# EAGLE design PIB Quadcopter PCB (EAGLE 9.6.2)
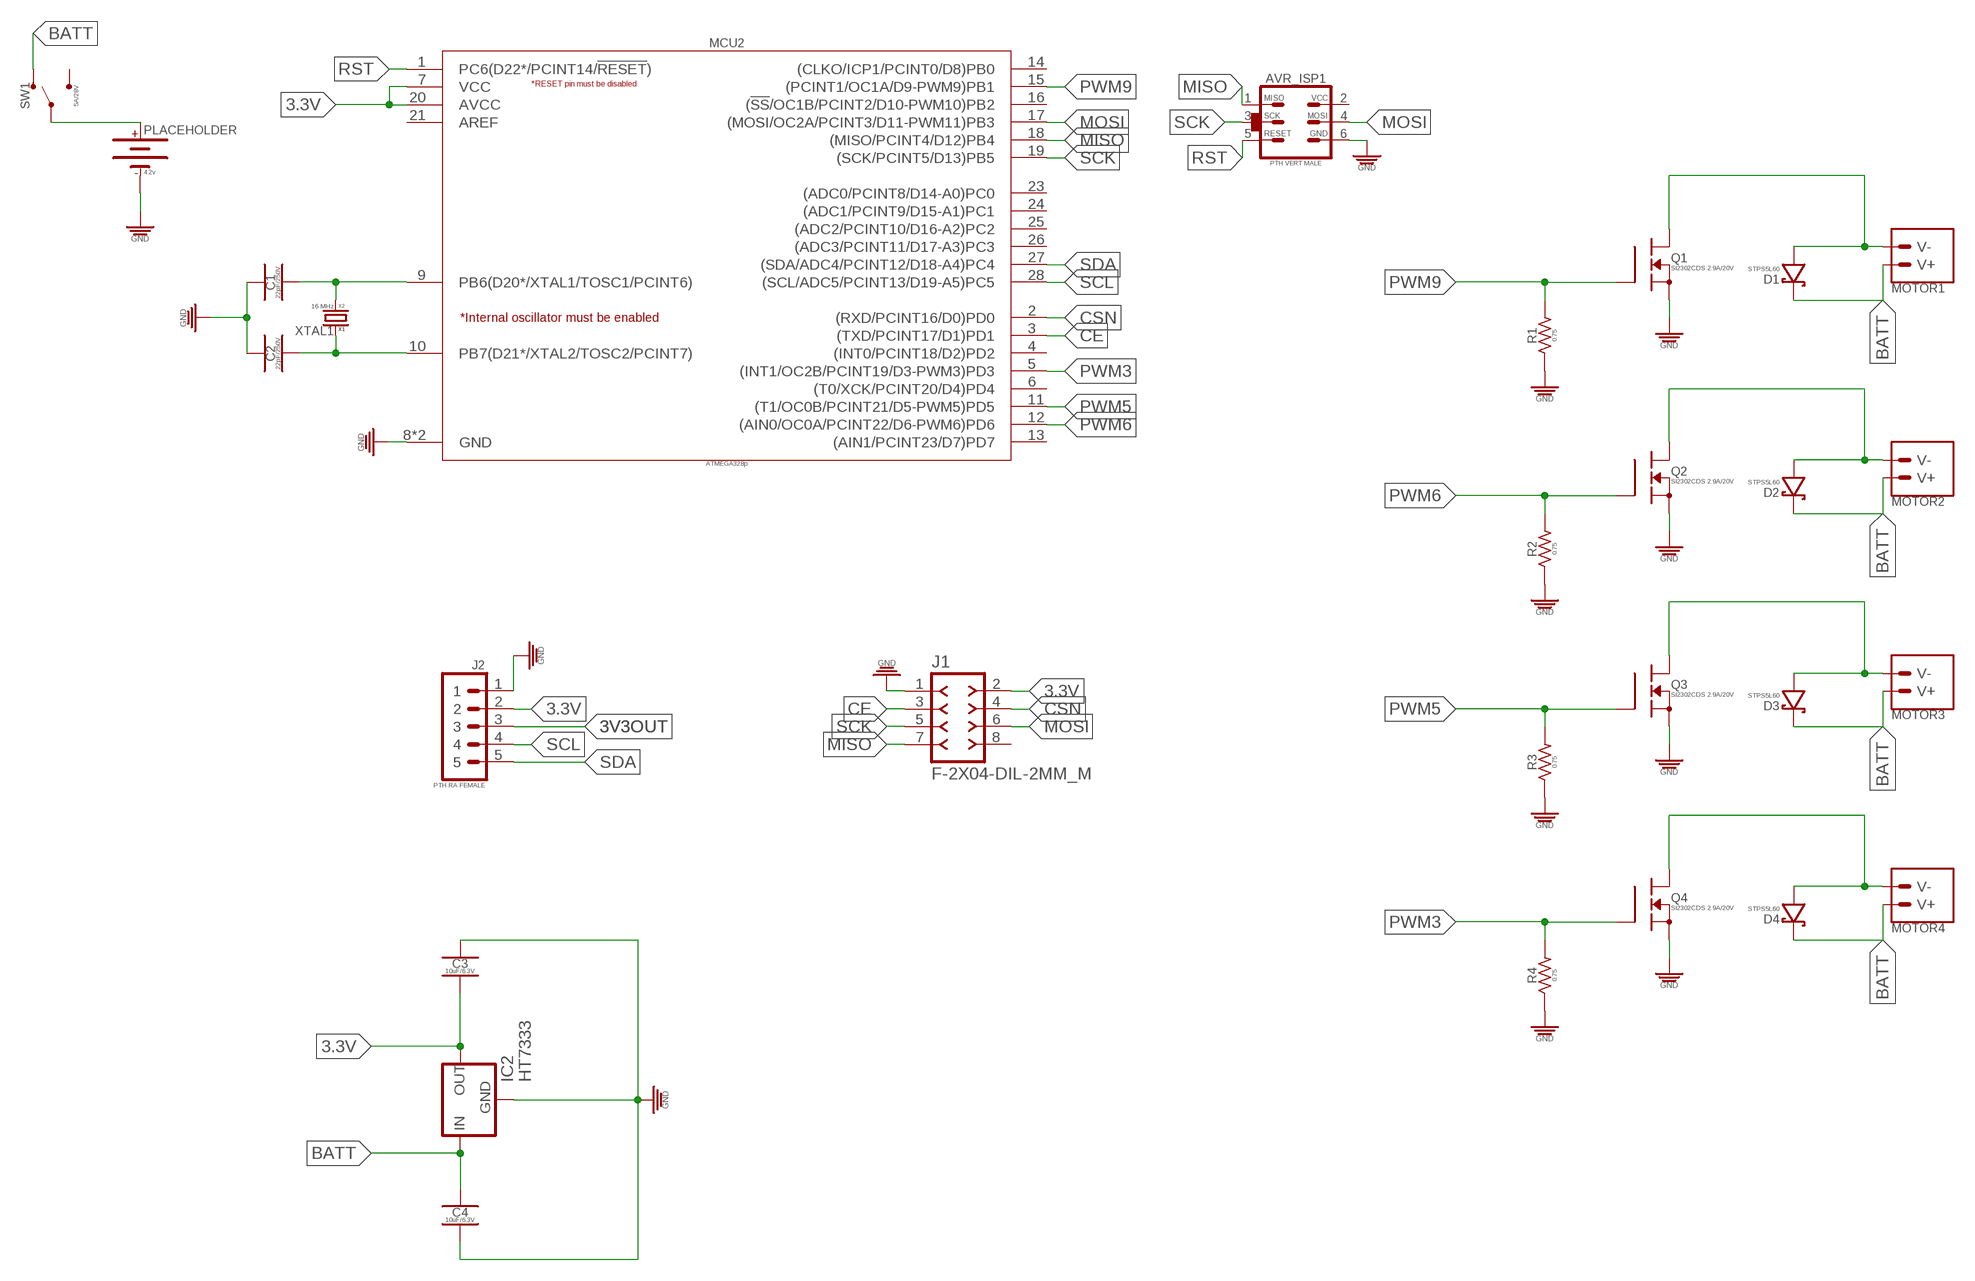
[diagram p0: schematic, sheet 1]

## Parts
AVR_ISP1  PTH VERT MALE  AVR_SPI_PRG_6_PTH_VERT_MALE_2.54MM  [HDRV6W64P254_2X3_762X483X838B_AVR-ISP]
C1  22pF/250V  22PF_CER_SMD-0603_250V-5%  [CAPC1608X95]
C2  22pF/250V  22PF_CER_SMD-0603_250V-5%  [CAPC1608X95]
C3  10uF/6.3V  10UF_CER_SMD-0402_6.3V-20%  [CAPC1005X55_SMD-0402]
C4  10uF/6.3V  10UF_CER_SMD-0402_6.3V-20%  [CAPC1005X55_SMD-0402]
D1  STPS5L60  SCHOTTKY_POWER-SCHOTTKY_5A-60V_D0-201AD  [D0-201AD]
D2  STPS5L60  SCHOTTKY_POWER-SCHOTTKY_5A-60V_D0-201AD  [D0-201AD]
D3  STPS5L60  SCHOTTKY_POWER-SCHOTTKY_5A-60V_D0-201AD  [D0-201AD]
D4  STPS5L60  SCHOTTKY_POWER-SCHOTTKY_5A-60V_D0-201AD  [D0-201AD]
IC2  HT7333  [SOT-89]
J1  F-2X04-DIL-2MM_M  [DIL-2MM-2X04_M]
J2  PTH RA FEMALE  1X05_PTH_RA_FEMALE_2.54MM  [HDRRAR5W60P254_1X5_1320X850X274B]
MCU2  ATMEGA328p  ATMEGA328P-28_28-PDIP_8BIT_32KB  [DIP762W53P254L3467H472Q28B]
MOTOR1  MOTOR_PADSPTH  [CONNECTOR_MOTOR]
MOTOR2  MOTOR_PADSPTH  [CONNECTOR_MOTOR]
MOTOR3  MOTOR_PADSPTH  [CONNECTOR_MOTOR]
MOTOR4  MOTOR_PADSPTH  [CONNECTOR_MOTOR]
PLACEHOLDER  4.2v  BATTERY-CONNECTOR_MOLEX_89400_VERT-MALE_PITCH-2MM  [BATTERY_MOLEX-89400_VERT_PITCH-2MM]
Q1  SI2302CDS 2.9A/20V  MOSFET_N-CHANNEL_SI2302CDS_2.9A-20V-0.057OHM_  [SOT95P287X112-3]
Q2  SI2302CDS 2.9A/20V  MOSFET_N-CHANNEL_SI2302CDS_2.9A-20V-0.057OHM_  [SOT95P287X112-3]
Q3  SI2302CDS 2.9A/20V  MOSFET_N-CHANNEL_SI2302CDS_2.9A-20V-0.057OHM_  [SOT95P287X112-3]
Q4  SI2302CDS 2.9A/20V  MOSFET_N-CHANNEL_SI2302CDS_2.9A-20V-0.057OHM_  [SOT95P287X112-3]
R1  0.75  0.75Ω_SMD-0603_1/8W-5%  [RESC1608X65_SMD-0603]
R2  0.75  0.75Ω_SMD-0603_1/8W-5%  [RESC1608X65_SMD-0603]
R3  0.75  0.75Ω_SMD-0603_1/8W-5%  [RESC1608X65_SMD-0603]
R4  0.75  0.75Ω_SMD-0603_1/8W-5%  [RESC1608X65_SMD-0603]
SW1  5A/28V  SWITCH_SPDT_VERT_PTH_5A-28V_13L-7W_  [SW_TOGGLE_SPDT_5A-28V_13L-7W]
XTAL1  16 MHz  CRYSTAL_ABL_16MHZ_18PF  [HC-49/US]

## Nets
3.3V: C3.2 IC2.1(OUT) J1.2 J2.2 MCU2.7(VCC) MCU2.20(AVCC)
3V3OUT: J2.3
BATT: C4.1 D1.K(A) D2.K(A) D3.K(A) D4.K(A) IC2.3(IN) IC2.4(IN) MOTOR1.+(V+) MOTOR2.+(V+) MOTOR3.+(V+) MOTOR4.+(V+) SW1.S1
CE: J1.3 MCU2.3((TXD/PCINT17/D1)PD1)
CSN: J1.4 MCU2.2((RXD/PCINT16/D0)PD0)
GND: AVR_ISP1.GND C1.1 C2.1 C3.1 C4.2 IC2.2(GND) J1.1 J2.1 MCU2.8(GND) MCU2.22(GND) PLACEHOLDER.- Q1.2(S) Q2.2(S) Q3.2(S) Q4.2(S) R1.1 R2.1 R3.1 R4.1
MISO: AVR_ISP1.MISO J1.7 MCU2.18((MISO/PCINT4/D12)PB4)
MOSI: AVR_ISP1.MOSI J1.6 MCU2.17((MOSI/OC2A/PCINT3/D11-PWM11)PB3)
N$1: D2.A(K) MOTOR2.-(V-) Q2.3(D)
N$2: D3.A(K) MOTOR3.-(V-) Q3.3(D)
N$3: D4.A(K) MOTOR4.-(V-) Q4.3(D)
N$4: C1.2 MCU2.9(PB6(D20*/XTAL1/TOSC1/PCINT6)) XTAL1.P$2(XTAL2)
N$5: C2.2 MCU2.10(PB7(D21*/XTAL2/TOSC2/PCINT7)) XTAL1.P$1(XTAL1)
N$6: D1.A(K) MOTOR1.-(V-) Q1.3(D)
N$9: PLACEHOLDER.+ SW1.P
PWM3: MCU2.5((INT1/OC2B/PCINT19/D3-PWM3)PD3) Q4.1(G) R4.2
PWM5: MCU2.11((T1/OC0B/PCINT21/D5-PWM5)PD5) Q3.1(G) R3.2
PWM6: MCU2.12((AIN0/OC0A/PCINT22/D6-PWM6)PD6) Q2.1(G) R2.2
PWM9: MCU2.15((PCINT1/OC1A/D9-PWM9)PB1) Q1.1(G) R1.2
RST: AVR_ISP1.RESET MCU2.1(PC6(D22*/PCINT14/!RESET!))
SCK: AVR_ISP1.SCK J1.5 MCU2.19((SCK/PCINT5/D13)PB5)
SCL: J2.4 MCU2.28((SCL/ADC5/PCINT13/D19-A5)PC5)
SDA: J2.5 MCU2.27((SDA/ADC4/PCINT12/D18-A4)PC4)
Unconnected: AVR_ISP1.VCC J1.8 MCU2.4((INT0/PCINT18/D2)PD2) MCU2.6((T0/XCK/PCINT20/D4)PD4) MCU2.13((AIN1/PCINT23/D7)PD7) MCU2.14((CLKO/ICP1/PCINT0/D8)PB0) MCU2.16((!SS!/OC1B/PCINT2/D10-PWM10)PB2) MCU2.21(AREF) MCU2.23((ADC0/PCINT8/D14-A0)PC0) MCU2.24((ADC1/PCINT9/D15-A1)PC1) MCU2.25((ADC2/PCINT10/D16-A2)PC2) MCU2.26((ADC3/PCINT11/D17-A3)PC3) SW1.S2

## Library data of the parts
AVR_ISP1 = PiB_connectors:AVR_SPI_PRG_6: AVR ISP 6 Pin This is the reduced ISP connector for AVR programming. Common on Arduino. This footprint will take up less PCB space and can be used with a 10-pin to 6-pin adapter such as SKU: BOB-08508; DATASHEET: https://cdn.amphenol-icc.com/media/wysiwyg/files/drawing/67996.pdf; DIST: Digikey; DISTLINK: https://www.digikey.com/products/en?keywords=609-3234-ND; DISTPN: 609-3234-ND; MFR: Amphenol FCI; MPN: 67997-206HLF
C1 C2 = PiB_capacitors:22PF; DATASHEET: http://www.yageo.com/NewPortal/_en/search/productDocs.jsp?YageoPartNumber=AC0603JRNPOYBN220; DIST: Digikey; DISTLINK: https://www.digikey.com/products/en?keywords=311-3095-1-ND; DISTPN: 311-3095-1-ND; MFR: Yageo; MPN: AC0603JRNPOYBN220
C3 C4 = PiB_capacitors:10UF; DATASHEET: https://www.murata.com/~/media/webrenewal/support/library/catalog/products/capacitor/mlcc/c02e.ashx; DIST: Digikey; DISTLINK: https://www.digikey.com/products/en?keywords=490-13233-1-ND; DISTPN: 490-13233-1-ND; MFR: Murata Electronics North America; MPN: GRM155C80J106ME11D
D1-D4 = PiB_discrete_semiconductors:SCHOTTKY; CREATOR: MrSwirlyEyes; DATASHEET: http://www.st.com/content/ccc/resource/technical/document/datasheet/57/3c/bc/f9/25/f5/43/2b/CD00002924.pdf/files/CD00002924.pdf/jcr:content/translations/en.CD00002924.pdf; DIST: Digikey; DISTLINK: https://www.digikey.com/product-detail/en/stmicroelectronics/STPS5L60/497-12673-1-ND/2864639; DISTPN: 497-12673-1-ND; MFR: STMicroelectronics; MPN: STPS5L60; TESTED: NO
IC2 = holtek2:HT73*
J1 = con-headers-jp:F-2X04-: FEMALE HEADER
J2 = PiB_connectors:1X05; DATASHEET: http://www.sullinscorp.com/drawings/78_P(N)PxCxx1LGBN-RC,_10493-G.pdf; DIST: Digikey; DISTLINK: https://www.digikey.com/products/en?keywords=PPTC051LGBN-RC; DISTPN: S5441-ND; MFR: Sullins Connector Solutions; MPN: PPTC051LGBN-RC
MCU2 = PiB_ic_microcontrollers:ATMEGA328P-28: ATMEGA328P 28PIN IC; DATASHEET: http://ww1.microchip.com/downloads/en/DeviceDoc/Atmel-42735-8-bit-AVR-Microcontroller-ATmega328-328P_Datasheet.pdf; DIST: Digikey; DISTLINK: https://www.digikey.com/products/en?keywords=ATMEGA328P-PU-ND; DISTPN: ATMEGA328P-PU-ND; MFR: Microchip Technology; MPN: ATMEGA328P-PU
MOTOR1-MOTOR4 = PiB_motors:MOTOR_PADS
PLACEHOLDER = PiB_batteries:BATTERY-CONNECTOR_MOLEX; DATASHEET: https://www.molex.com/pdm_docs/sd/894000220_sd.pdf; DATASHEET_CONNECTOR: https://www.molex.com/pdm_docs/sd/873690200_sd.pdf; DATASHEET_CRIMP: https://www.molex.com/pdm_docs/sd/502128000_sd.pdf; DIST: Digikey; DISTLINK: https://www.digikey.com/products/en?keywords=WM4340-ND; DISTLINK_CONNECTOR: https://www.digikey.com/products/en?keywords=WM10118-ND; DISTLINK_CRIMP: https://www.digikey.com/products/en?keywords=WM4561CT-ND; DISTPN: WM4340-ND; DISTPN_CONNECTOR: WM10118-ND; DISTPN_CRIMP: WM4561CT-ND; DIST_CONNECTOR: Digikey; DIST_CRIMP: Digikey; MFR: Molex, LLC; MFR_CONNECTOR: Molex, LLC; MFR_CRIMP: Molex, LLC; MPN: 0894000220; MPN_CONNECTOR: 0873690200; MPN_CRIMP: 50212-8000; VALUE: 7.4V
Q1-Q4 = PiB_transistors:MOSFET_N-CHANNEL; DATASHEET: http://www.vishay.com/docs/63653/si2302dds.pdf; DIST: Digikey; DISTLINK: https://www.digikey.com/products/en?keywords=SI2302DDS-T1-GE3CT-ND; DISTPN: SI2302DDS-T1-GE3CT-ND; MFR: Vishay Siliconix; MPN: SI2302DDS-T1-GE3
R1-R4 = PiB_resistors:0.75Ω; DATASHEET: http://www.te.com/commerce/DocumentDelivery/DDEController?Action=srchrtrv&DocNm=1773269&DocType=DS&DocLang=English; DIST: Digikey; DISTLINK: https://www.digikey.com/products/en?keywords=A109779CT-ND; DISTPN: A109779CT-ND; MFR: TE Connectivity Passive Product; MPN: RLP73K1JR75JTD
SW1 = PiB_switches:SWITCH_SPDT; DATASHEET: http://spec_sheets.e-switch.com/specs/T111597.pdf; DIST: Digikey; DISTLINK: https://www.digikey.com/products/en?keywords=EG2355-ND; DISTPN: EG2355-ND; MFR: E-Switch; MPN: 100SP1T1B4M2QE
XTAL1 = PiB_crystals_oscillators_resonators:CRYSTAL: Various standard crystals. Proven footprints.; DATASHEET: https://abracon.com/Resonators/ABL.pdf; DIST: Digikey; DISTLINK: https://www.digikey.com/products/en?keywords=535-9041-ND; DISTPN: 535-9041-ND; MFR: Abracon LLC; MPN: ABL-16.000MHZ-B2

## Board
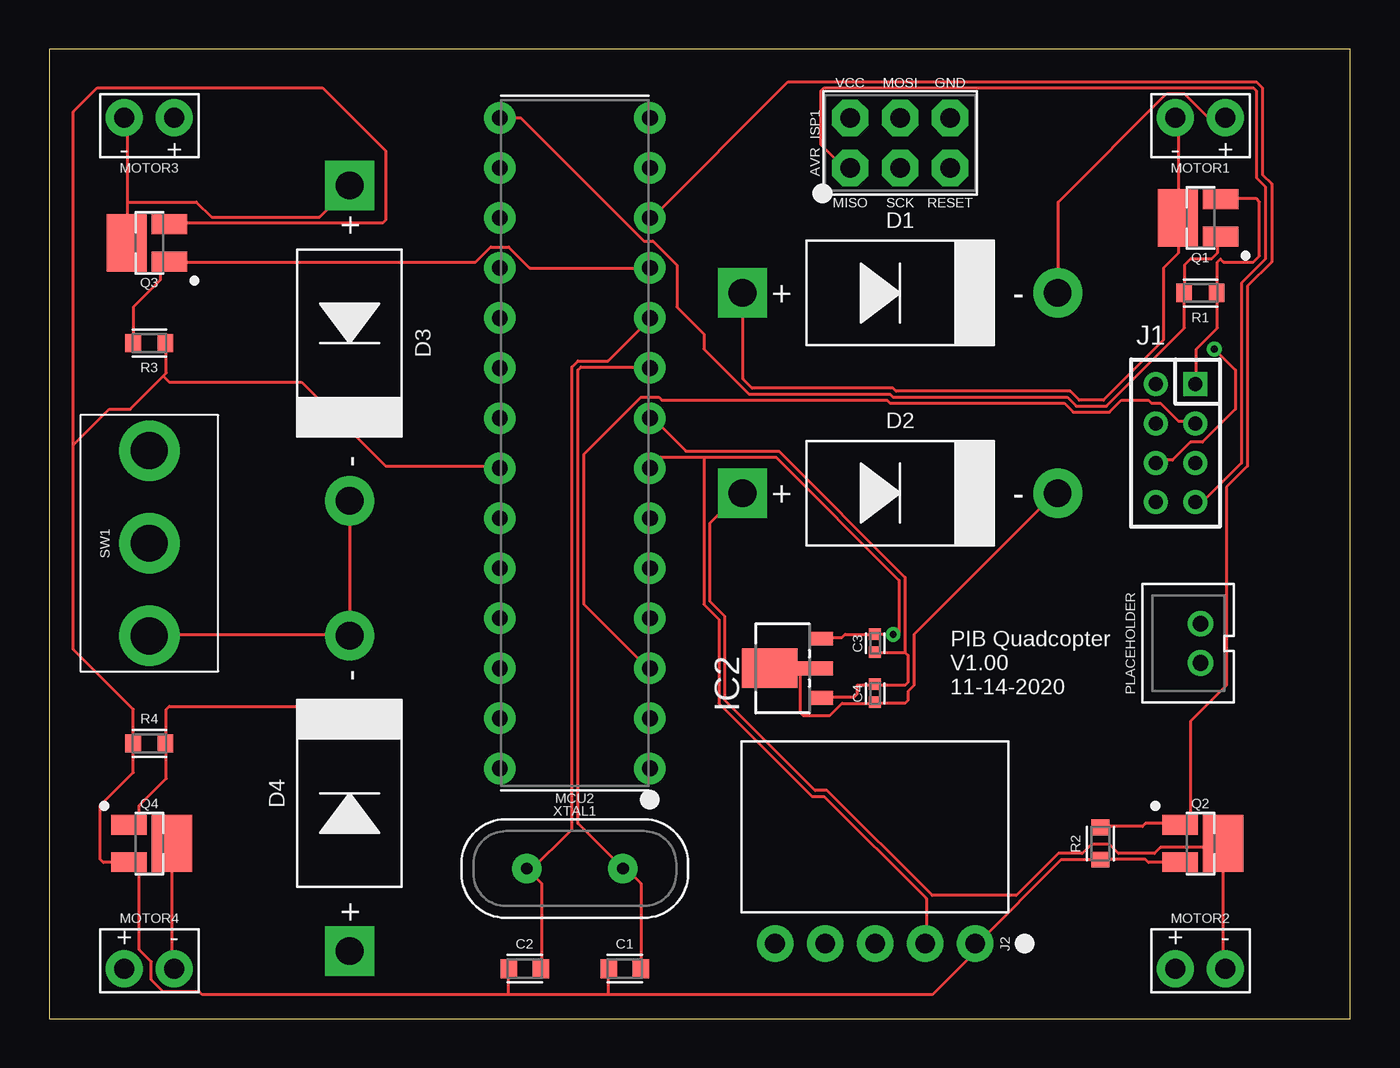
[diagram p1: board, top side]
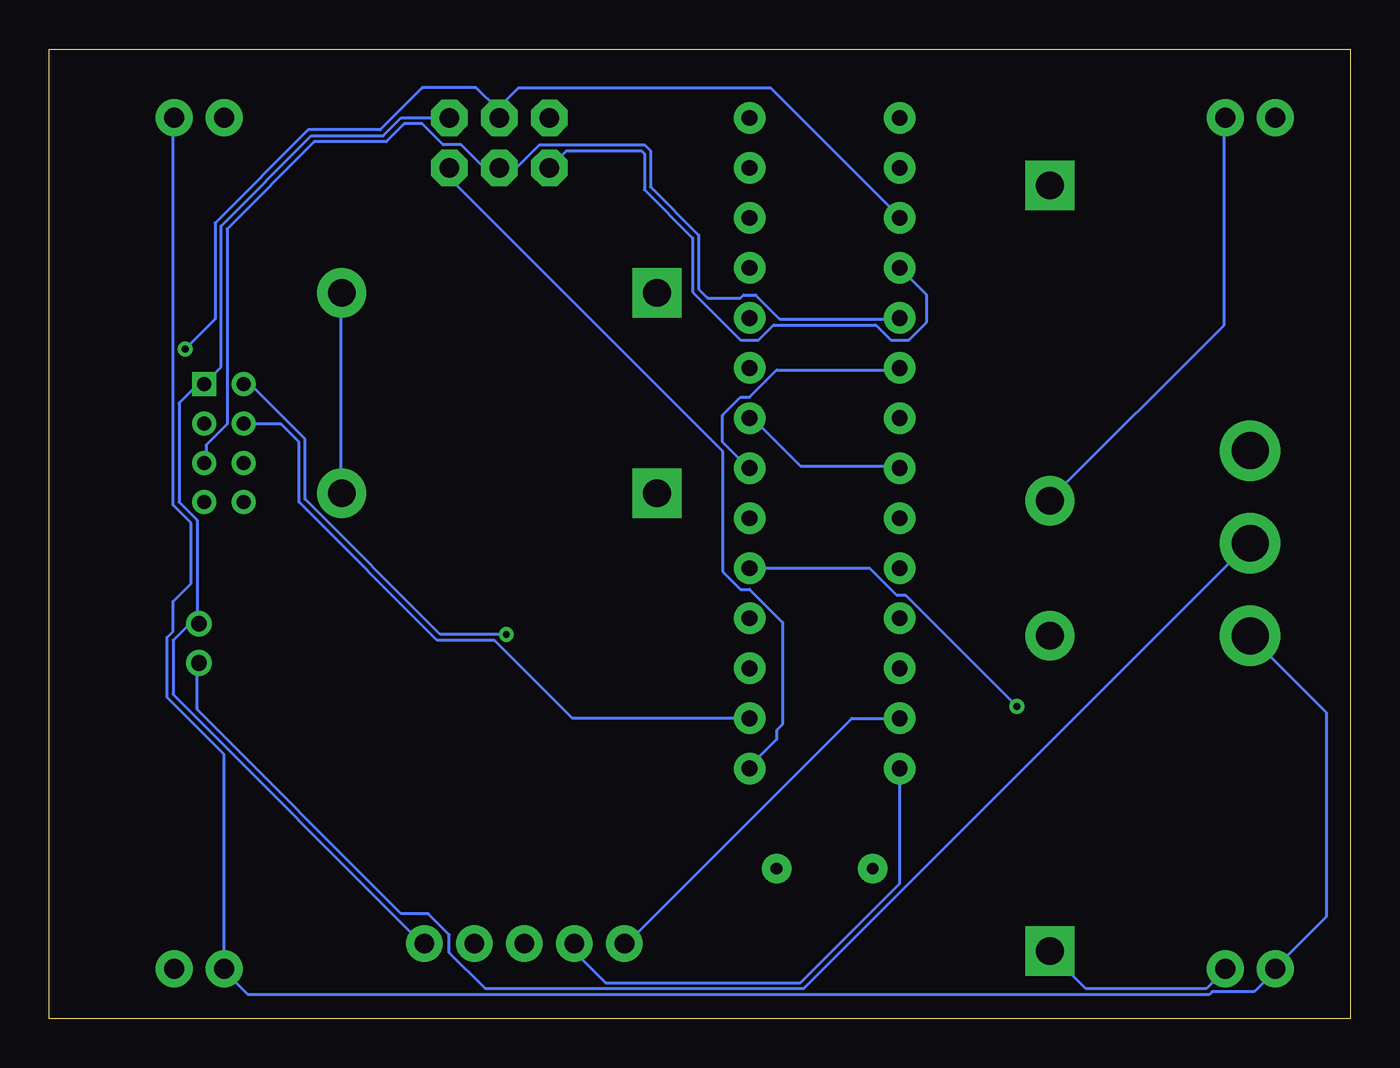
[diagram p2: board, bottom side, seen from below]

Size 66.02 x 49.2 mm. Coordinates in mm from the lower left corner, seen from the top.
Outline: 0,0 66.02,0 66.02,49.2 0,49.2 0,0
Copper layers (1*16): Top 0.035mm / dielectric 1.5mm / Bottom 0.035mm
Design rules "default": minimum track width 6mil, minimum drill 0.35mm, track to track 6mil, track to pad 6mil, pad to pad 6mil, via to via 6mil, smd to smd 6mil, copper to edge 40mil, drill to drill 6mil, minimum pad ring 10mil, minimum via ring 8mil, stop-mask expansion 4mil, vias tented up to drill 0mil, thermal gap 10mil

### Footprints (pad centres in the part's own frame; a part is rotated, then mirrored left to right if it is on the bottom)
HDRV6W64P254_2X3_762X483X838B_AVR-ISP = drill 1 pad 1.85 octagon: GND 5.08,2.54; MISO 0,0; MOSI 2.54,2.54; RESET 5.08,0; SCK 2.54,0; VCC 0,2.54
CAPC1608X95 = smd 0.846 x 0.97: 1 -0.812,0; 2 0.812,0
CAPC1005X55_SMD-0402 = smd 0.585 x 0.612: 1 -0.458,0; 2 0.458,0
D0-201AD = drill 1.4 pad 2.5 square: A -8,0 | drill 1.4 pad 2.5: K 8,0
SOT-89 = smd 0.7 x 1.1: 1 1.5,-2.385; 2 -1.5,-2.385 | smd 0.7 x 1.8: 3 0,-2.035 | smd 2 x 2.8: 4 0,0.265
DIL-2MM-2X04_M = drill 0.711 square: 1 -3,1 | drill 0.711: 2 -3,-1; 3 -1,1; 4 -1,-1; 5 1,1; 6 1,-1; 7 3,1; 8 3,-1
HDRRAR5W60P254_1X5_1320X850X274B = drill 1 pad 1.85: 1 0,0; 2 2.54,0; 3 5.08,0; 4 7.62,0; 5 10.16,0
DIP762W53P254L3467H472Q28B = drill 0.799 pad 1.599: 1 -3.81,16.51; 2 -3.81,13.97; 3 -3.81,11.43; 4 -3.81,8.89; 5 -3.81,6.35; 6 -3.81,3.81; 7 -3.81,1.27; 8 -3.81,-1.27; 9 -3.81,-3.81; 10 -3.81,-6.35; 11 -3.81,-8.89; 12 -3.81,-11.43; 13 -3.81,-13.97; 14 -3.81,-16.51; 15 3.81,-16.51; 16 3.81,-13.97; 17 3.81,-11.43; 18 3.81,-8.89; 19 3.81,-6.35; 20 3.81,-3.81; 21 3.81,-1.27; 22 3.81,1.27; 23 3.81,3.81; 24 3.81,6.35; 25 3.81,8.89; 26 3.81,11.43; 27 3.81,13.97; 28 3.81,16.51
CONNECTOR_MOTOR = drill 1.016 pad 1.88: + -1.27,0; - 1.27,0
BATTERY_MOLEX-89400_VERT_PITCH-2MM = drill 0.8: + -1,0; - 1,0
SOT95P287X112-3 = smd 1.8 x 1: 1 -1.025,0.95; 2 -1.025,-0.95 | smd 2.05 x 2.9: 3 1.15,0
RESC1608X65_SMD-0603 = smd 0.788 x 0.929: 1 -0.82,0; 2 0.82,0
SW_TOGGLE_SPDT_5A-28V_13L-7W = drill 1.875 pad 3.075: P 0,0; S1 0,-4.7; S2 0,4.7
HC-49/US = drill 0.6 pad 1.5: P$1 -2.44,0; P$2 2.44,0

### Placement (x,y rotation side)
AVR_ISP1  40.64,43.18 0 top
C1  29.21,2.54 0 top
C2  24.13,2.54 0 top
C3  41.91,19.05 90 top
C4  41.91,16.51 90 top
D1  43.18,36.83 0 top
D2  43.18,26.67 0 top
D3  15.24,34.29 270 top
D4  15.24,11.43 90 top
IC2  36.83,17.78 90 top
J1  57.15,29.21 270 top
J2  46.99,3.81 180 top
MCU2  26.67,29.21 180 top
MOTOR1  58.42,45.72 180 top
MOTOR2  58.42,2.54 0 top
MOTOR3  5.08,45.72 180 top
MOTOR4  5.08,2.54 0 top
PLACEHOLDER  58.42,19.05 90 top
Q1  58.42,40.64 180 top
Q2  58.42,8.89 0 top
Q3  5.08,39.37 180 top
Q4  5.08,8.89 0 top
R1  58.42,36.83 180 top
R2  53.34,8.89 90 top
R3  5.08,34.29 180 top
R4  5.08,13.97 0 top
SW1  5.08,24.13 0 top
XTAL1  26.67,7.62 0 top

### Tracks (layer width: path | path; a pad name or v marks a point on that pad's centre or on a via)
3.3V  (via drill 0.35)
  Top 0.152: C3.2 40.39,19.51 40.23,19.36 39.32,19.36 IC2.1 | C3.2 v42.82,19.51 43.13,19.51 43.13,22.25 36.88,28.5 33.22,28.5 | 33.22,28.5 30.94,28.5 30.48,28.04 MCU2.7 | C3.2 | 33.22,28.5 33.22,21.03 33.98,20.27 33.98,16 38.71,11.28 39.32,11.28 44.5,6.1 44.5,3.81 J2.2
  Bottom 0.152: v42.82,19.51 46.18,19.51 53.03,26.36 53.03,29.41 55.78,32.16 56.08,32.16 J1.2 | MCU2.20 22.86,32.92 29.11,32.92 30.48,31.55 30.94,31.55 31.85,30.63 31.85,29.26 30.48,27.89 MCU2.7
BATT
  Top 0.152: MOTOR1.+ 58.83,45.72 57.61,46.94 56.69,46.94 51.21,41.45 51.21,36.88 D1.K | 41.91,16 40.23,16 39.62,15.39 38.25,15.39 38.1,15.54 38.1,17.83 | 38.1,17.83 36.58,17.83 IC2.4 | 38.1,17.83 38.86,17.83 IC2.3 | 41.91,16 43.43,16 43.59,16.15 43.59,16.61 43.89,16.92 43.89,19.51 51.05,26.67 D2.K | 41.91,16 C4.1 | D3.K 15.24,19.51 | 15.24,19.51 5.18,19.51 SW1.S1 | 15.24,19.51 D4.K
  Bottom 0.152: D1.K 51.21,36.73 51.21,26.67 D2.K | MOTOR3.+ 6.4,45.72 6.4,35.2 15.24,26.36 D3.K | SW1.S1 5.03,19.36 1.22,15.54 1.22,5.18 3.81,2.59 MOTOR4.+ 3.81,2.44 4.88,1.37 7.01,1.37 7.16,1.22 55.93,1.22 57.15,2.44 MOTOR2.+ 57.15,13.41 60.05,16.31 60.05,19.36 59.74,19.66 59.74,21.18 58.83,22.1 58.83,25.15 59.74,26.06 59.74,45.72 MOTOR1.+
CE
  Top 0.152: J1.3 58.06,30.33 57.3,30.33 56.39,31.24 55.93,31.24 55.78,31.39 54.41,31.39 53.8,30.79 51.97,30.79 51.51,31.24 42.67,31.24 42.52,31.39 31.09,31.39 30.94,31.55 30.02,31.55 27.13,28.65 27.13,21.03 30.48,17.68 MCU2.3
CSN
  Bottom 0.152: MCU2.2 39.47,15.24 43.43,19.2 46.33,19.2 53.34,26.21 53.34,29.26 54.25,30.18 56.08,30.18 J1.4
GND
  Top 0.152: 41.91,16.92 43.43,16.92 43.59,17.07 43.59,18.44 43.43,18.59 | C3.1 43.43,18.59 | C3.1 | 41.91,16.92 41,16.92 41,16.46 40.84,16.31 39.32,16.31 IC2.2 | 41.91,16.92 C4.2 | 43.43,18.59 43.43,22.4 37.03,28.8 32.31,28.8 30.63,30.48 MCU2.8 | 5.79,32.61 4.12,30.94 3.05,30.94 1.22,29.11 | 5.79,32.61 5.94,32.77 5.94,34.29 R3.1 | 1.22,29.11 1.22,18.75 4.27,15.7 4.27,14.02 R4.1 4.27,13.87 4.27,12.5 2.59,10.82 2.59,8.08 2.74,7.92 3.96,7.92 Q4.2 4.12,7.92 4.57,7.92 4.57,3.5 5.18,2.9 5.18,1.98 5.79,1.37 7.62,1.37 7.77,1.22 23.32,1.22 | 1.22,29.11 1.22,46.02 2.44,47.24 13.87,47.24 17.07,44.04 17.07,40.54 16.92,40.39 6.25,40.39 Q3.2 | 5.79,32.61 6.1,32.31 12.8,32.31 17.07,28.04 22.86,28.04 MCU2.22 | R2.1 55.63,8.08 55.78,7.92 57.3,7.92 Q2.2 | 23.32,1.22 23.32,2.44 C2.1 | 28.35,1.22 23.32,1.22 | 28.35,1.22 28.35,2.44 C1.1 | 28.35,1.22 44.81,1.22 46.94,3.35 46.94,3.81 J2.1 47.09,3.81 51.36,8.08 R2.1 | R2.1 | J1.1 58.22,32.31 58.22,33.98 59.28,35.05 59.28,36.73 R1.1 59.28,36.88 59.28,38.41 59.44,38.56 59.59,38.41 61.11,38.41 61.42,38.71 61.42,41.45 61.27,41.6 59.59,41.6 Q1.2
  Bottom 0.152: MCU2.8 30.33,30.48 27.89,28.04 22.86,28.04 MCU2.22 | AVR_ISP1.GND 48.16,45.72 49.07,44.81 52.73,44.81 57.3,40.23 57.3,33.07 58.06,32.31 J1.1 58.22,32.16 58.52,32.16 59.44,31.24 59.44,26.21 58.52,25.3 58.52,20.12 PLACEHOLDER.- 58.52,19.96 58.98,19.96 59.74,19.2 59.74,16.46 47.09,3.81 J2.1
MISO
  Top 0.152: J1.7 58.22,26.21 58.52,26.21 60.5,28.19 60.5,37.34 61.72,38.56 61.72,42.22 61.27,42.67 61.27,47.09 61.11,47.24 39.32,47.24 39.17,47.09 39.17,44.35 40.23,43.28 40.54,43.28 AVR_ISP1.MISO
  Bottom 0.152: MCU2.18 21.49,36.73 21.49,35.36 22.4,34.44 23.32,34.44 24.08,35.2 29.26,35.2 30.02,34.44 30.94,34.44 33.38,36.88 33.38,39.62 35.81,42.06 35.81,43.89 35.97,44.04 39.78,44.04 AVR_ISP1.MISO
MOSI  (via drill 0.35)
  Top 0.152: v59.13,33.98 60.2,32.92 60.2,30.94 58.52,29.26 57.91,29.26 57,28.35 56.24,28.35 J1.6
  Bottom 0.152: v59.13,33.98 57.61,35.51 57.61,40.39 52.88,45.11 49.23,45.11 47.09,47.24 44.35,47.24 43.28,46.18 | 43.28,46.18 43.28,45.72 AVR_ISP1.MOSI 43.28,46.18 | 43.28,46.18 42.22,47.24 29.41,47.24 22.86,40.69 MCU2.17
N$1
  Top 0.152: 59.59,8.69 59.59,2.59 MOTOR2.- | 59.59,8.69 59.59,8.84 Q2.3 59.59,8.69 | 59.59,8.69 56.39,8.69 56.08,8.38 54.25,8.38 53.8,8.84 52.88,8.84 52.43,8.38 51.21,8.38 49.07,6.25 44.81,6.25 39.47,11.58 38.86,11.58 34.29,16.15 34.29,20.42 33.53,21.18 33.53,25.15 35.05,26.67 D2.A
N$2
  Top 0.152: 3.96,41.45 3.96,45.57 MOTOR3.- | 3.96,41.45 3.96,39.47 Q3.3 | 3.96,41.45 7.47,41.45 8.23,40.69 13.72,40.69 15.24,42.22 D3.A
N$3
  Top 0.152: Q4.3 6.25,8.84 6.25,2.59 MOTOR4.-
  Bottom 0.152: D4.A 15.24,3.35 13.41,1.52 7.32,1.52 6.4,2.44 MOTOR4.-
N$4
  Top 0.152: C1.2 30.02,2.59 30.02,6.86 29.26,7.62 XTAL1.P$2 26.82,9.91 26.82,32.92 26.98,33.07 30.48,33.07 MCU2.9
N$5
  Top 0.152: 24.38,7.47 XTAL1.P$1 24.38,7.47 | 24.38,7.47 24.99,6.86 24.99,2.59 C2.2 | 24.38,7.47 26.52,9.6 26.52,33.07 26.82,33.38 28.35,33.38 30.48,35.51 MCU2.10
N$6
  Top 0.152: MOTOR1.- 57.3,45.57 57.3,40.69 Q1.3 57.3,40.54 57.3,38.86 56.54,38.1 56.54,34.44 53.49,31.39 52.27,31.39 51.82,31.85 42.98,31.85 42.82,32 35.66,32 35.2,32.46 35.2,36.73 D1.A
N$9
  Bottom 0.152: PLACEHOLDER.+ 58.52,17.98 58.52,15.7 48.16,5.33 46.79,5.33 45.72,4.27 45.72,3.35 43.89,1.52 27.74,1.52 5.18,24.08 SW1.P
PWM3  (via drill 0.35)
  Top 0.152: Q4.1 4.12,9.91 4.57,9.91 4.57,10.82 5.94,12.19 5.94,13.87 R4.2 5.94,14.02 5.94,15.7 6.1,15.85 v16.92,15.85
  Bottom 0.152: MCU2.5 24.38,22.86 23.01,21.49 22.55,21.49 v16.92,15.85
PWM5
  Top 0.152: R3.2 4.27,36.12 5.64,37.49 5.64,38.41 6.1,38.41 Q3.1 6.25,38.41 21.64,38.41 22.4,39.17 23.32,39.17 24.38,38.1 MCU2.11
PWM6
  Top 0.152: R2.2 53.34,9.75 55.47,9.75 55.63,9.91 57.3,9.91 Q2.1 57.45,9.91 57.91,9.91 57.91,15.09 59.74,16.92 59.74,26.98 60.81,28.04 60.81,37.19 62.03,38.41 62.03,42.37 61.57,42.82 61.57,47.24 61.27,47.55 37.49,47.55 30.48,40.54 MCU2.12
PWM9
  Top 0.152: Q1.1 59.44,39.78 59.28,39.62 59.28,38.86 58.98,38.56 57.91,38.56 57.61,38.25 57.61,36.88 R1.2 57.61,36.73 57.61,35.05 53.65,31.09 52.12,31.09 51.66,31.55 42.82,31.55 42.67,31.7 35.51,31.7 33.22,33.98 33.22,34.75 31.85,36.12 31.85,38.25 30.63,39.47 30.18,39.47 23.93,45.72 MCU2.15
RST
  Bottom 0.152: AVR_ISP1.RESET 45.72,42.67 31.85,28.8 31.85,22.71 30.94,21.79 30.48,21.79 28.8,20.12 28.8,14.94 29.11,14.63 29.11,14.17 30.48,12.8 MCU2.1
SCK
  Bottom 0.152: J1.5 58.06,28.35 58.06,29.11 57,30.18 57,40.08 52.58,44.5 48.92,44.5 48.01,45.41 47.09,45.41 46.02,44.35 45.11,44.35 44.04,43.28 43.28,43.28 AVR_ISP1.SCK 43.13,43.28 42.22,43.28 41.15,44.35 35.81,44.35 35.51,44.04 35.51,42.22 33.07,39.78 33.07,37.03 32.61,36.58 30.94,36.58 30.79,36.73 30.18,36.73 28.96,35.51 22.86,35.51 MCU2.19
SCL
  Bottom 0.152: MCU2.28 22.86,6.86 27.89,1.83 37.8,1.83 39.32,3.35 39.32,3.81 J2.4
SDA
  Bottom 0.152: MCU2.27 25.3,15.24 36.73,3.81 J2.5

### Text on the board
tPlace: PIB Quadcopter / V1.00 / 11-14-2020